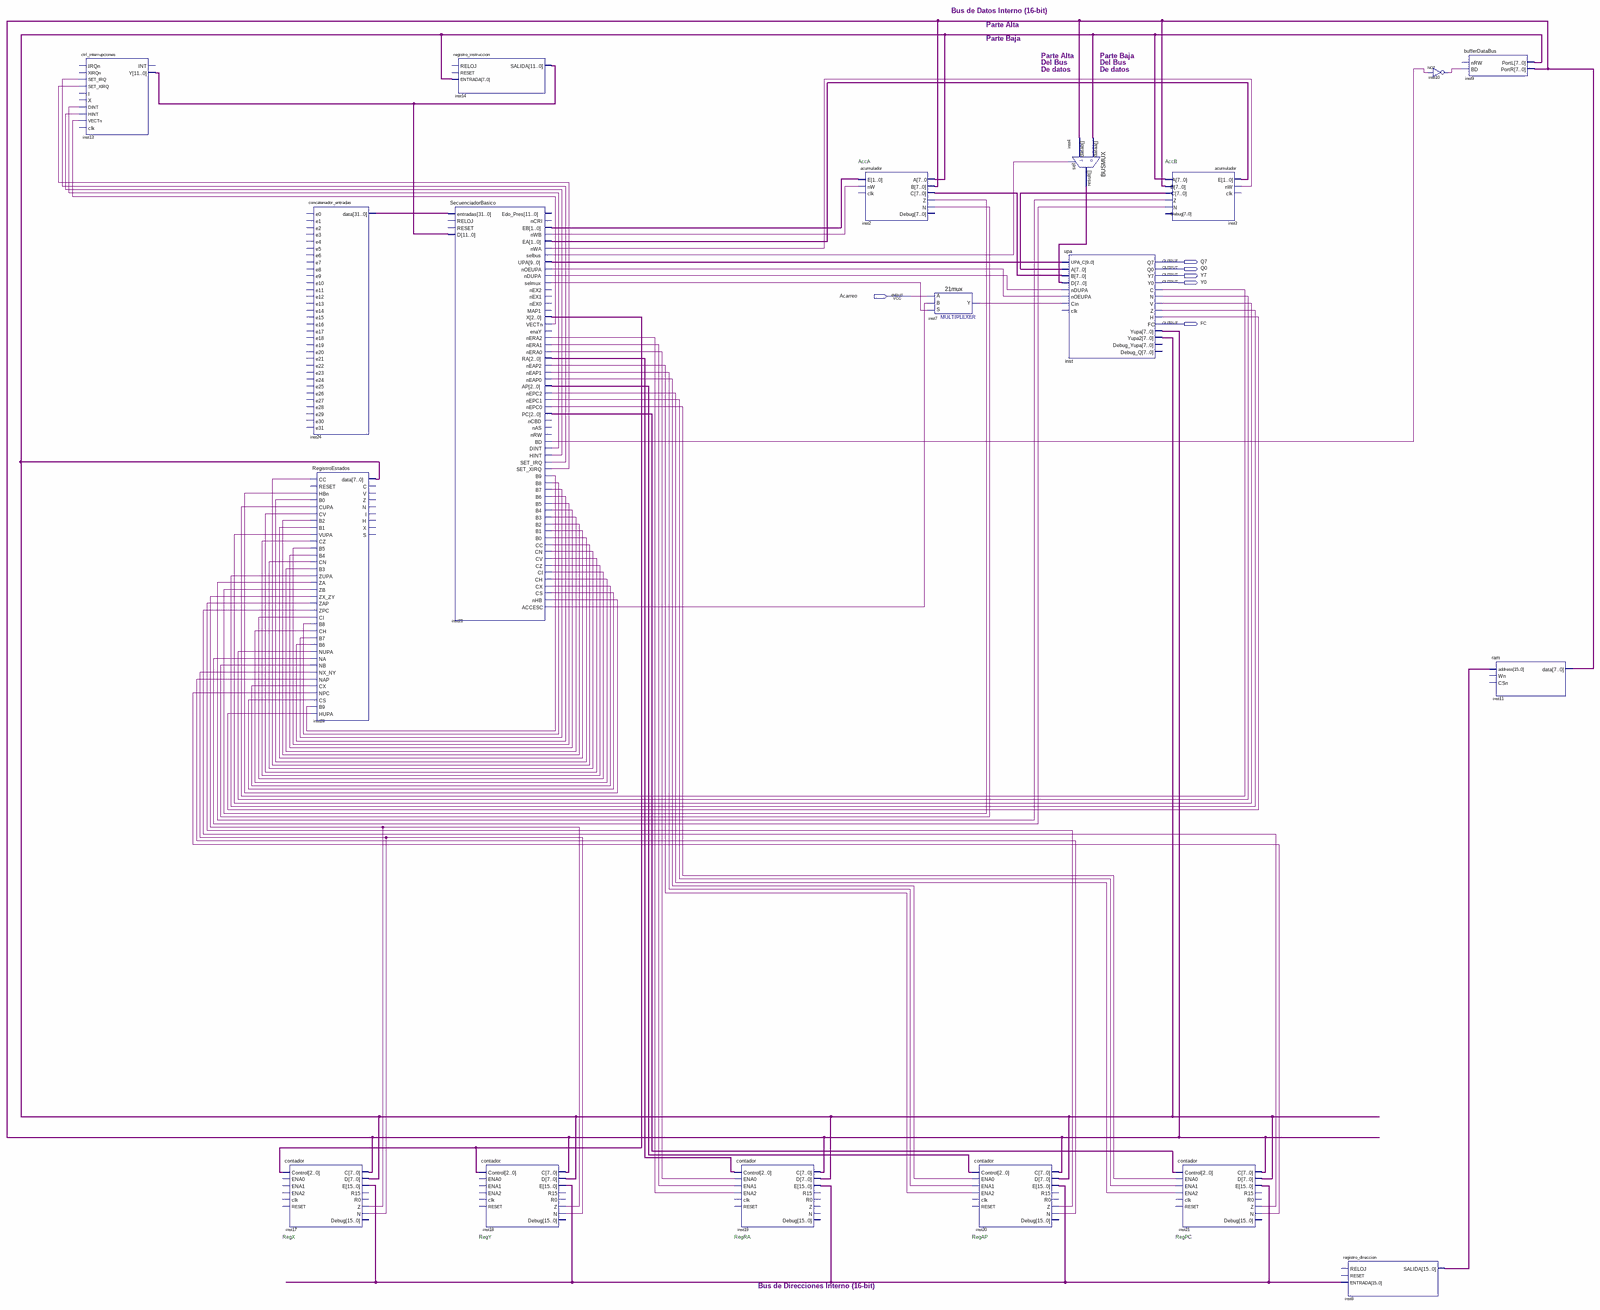
[diagram p0: schematic sheet, whole]
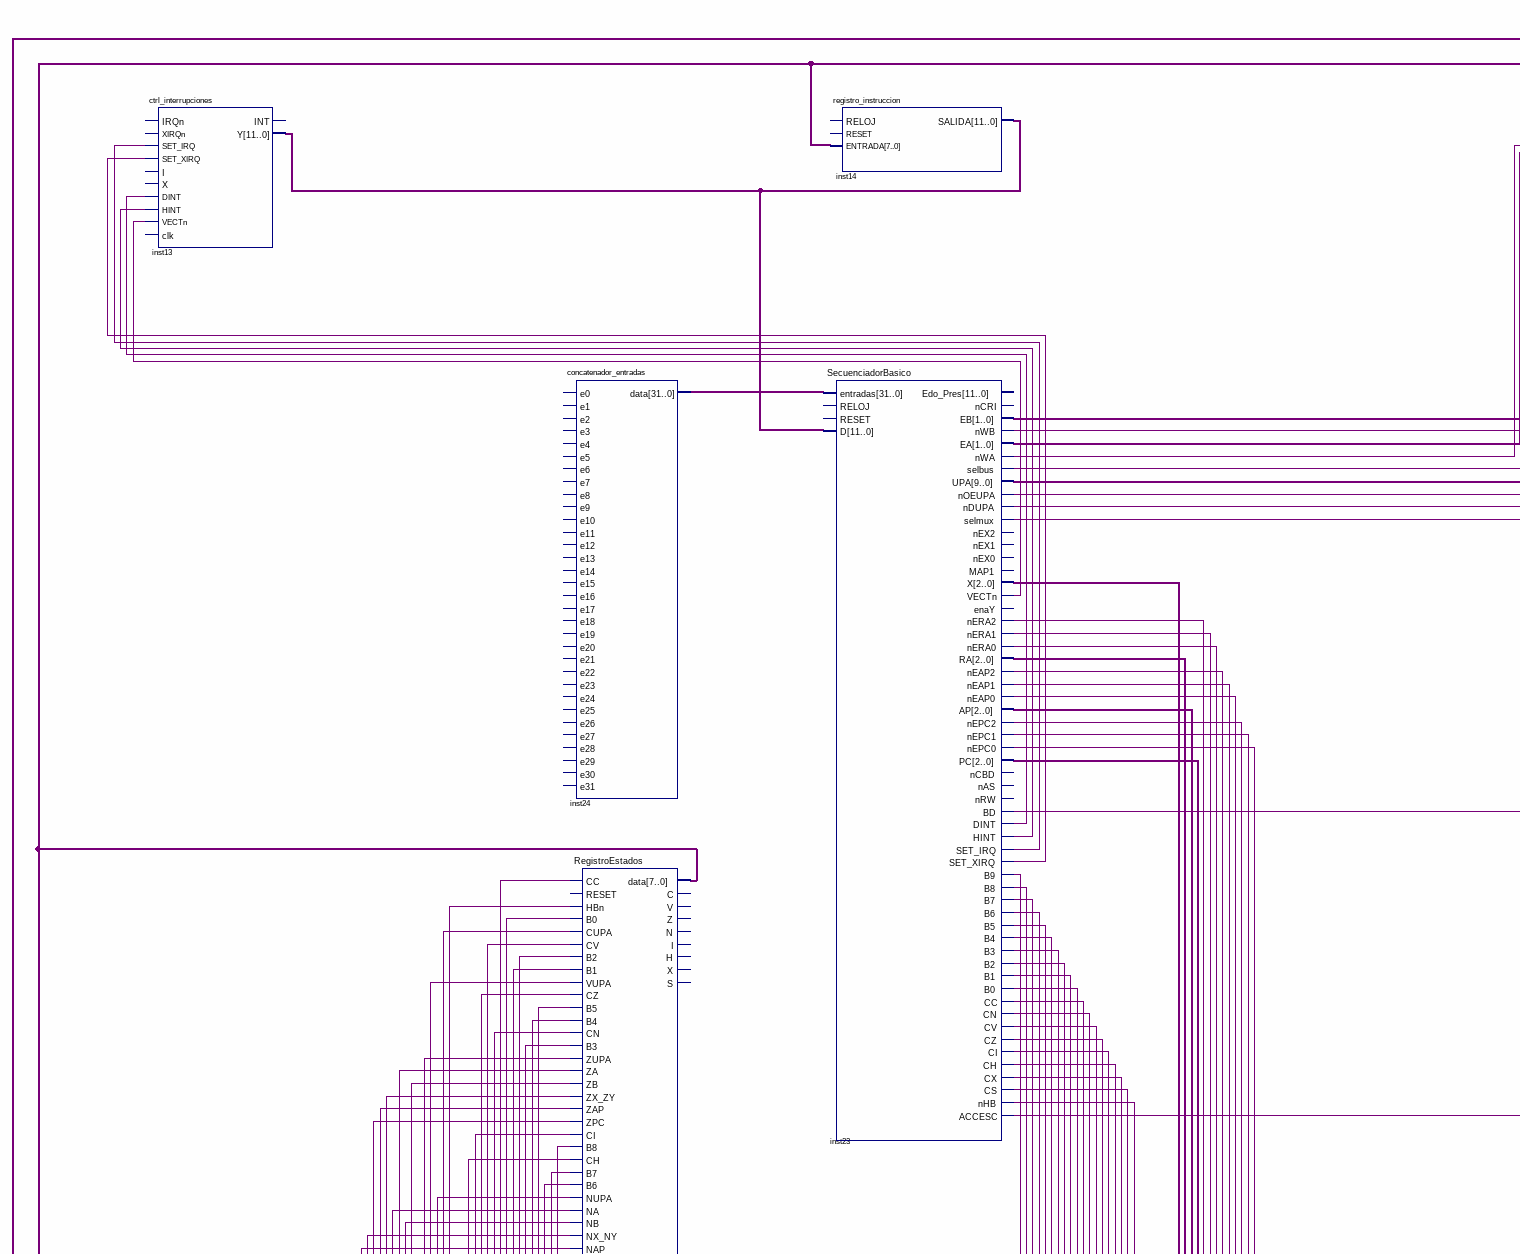
[diagram p1: schematic sheet, upper left part]
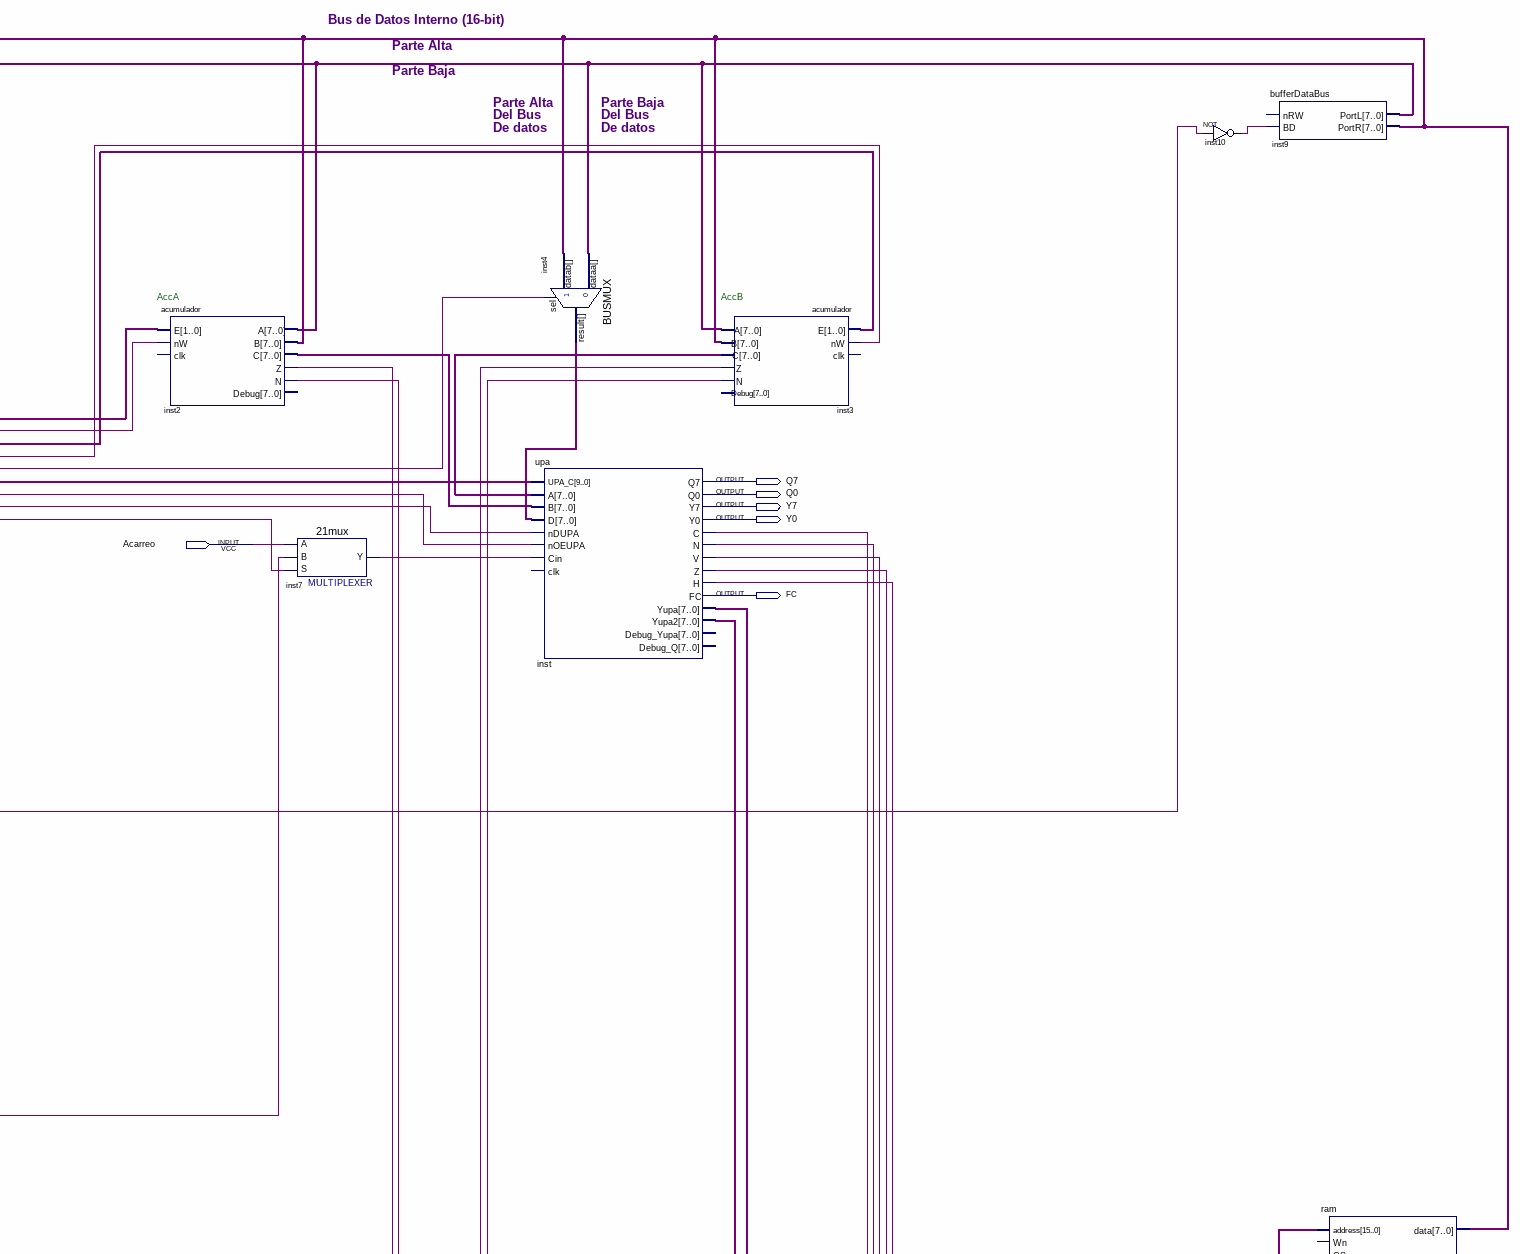
[diagram p2: schematic sheet, upper right part]
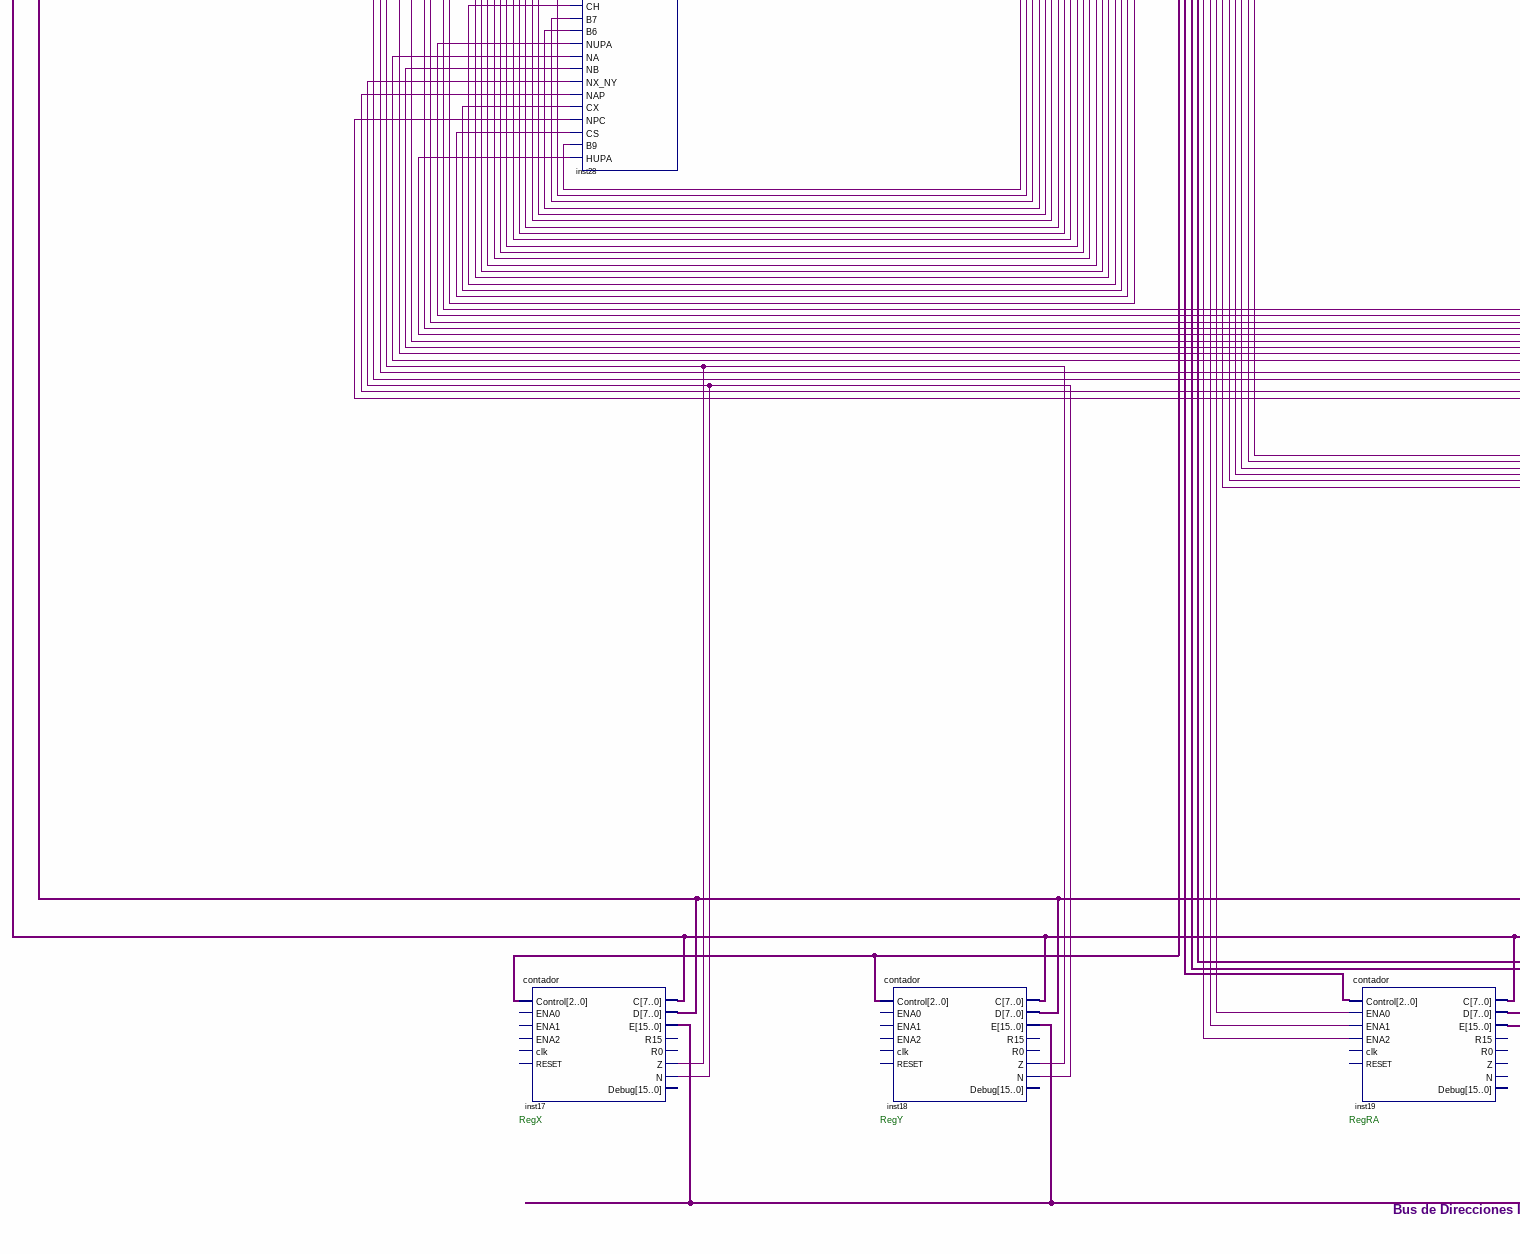
[diagram p3: schematic sheet, lower left part]
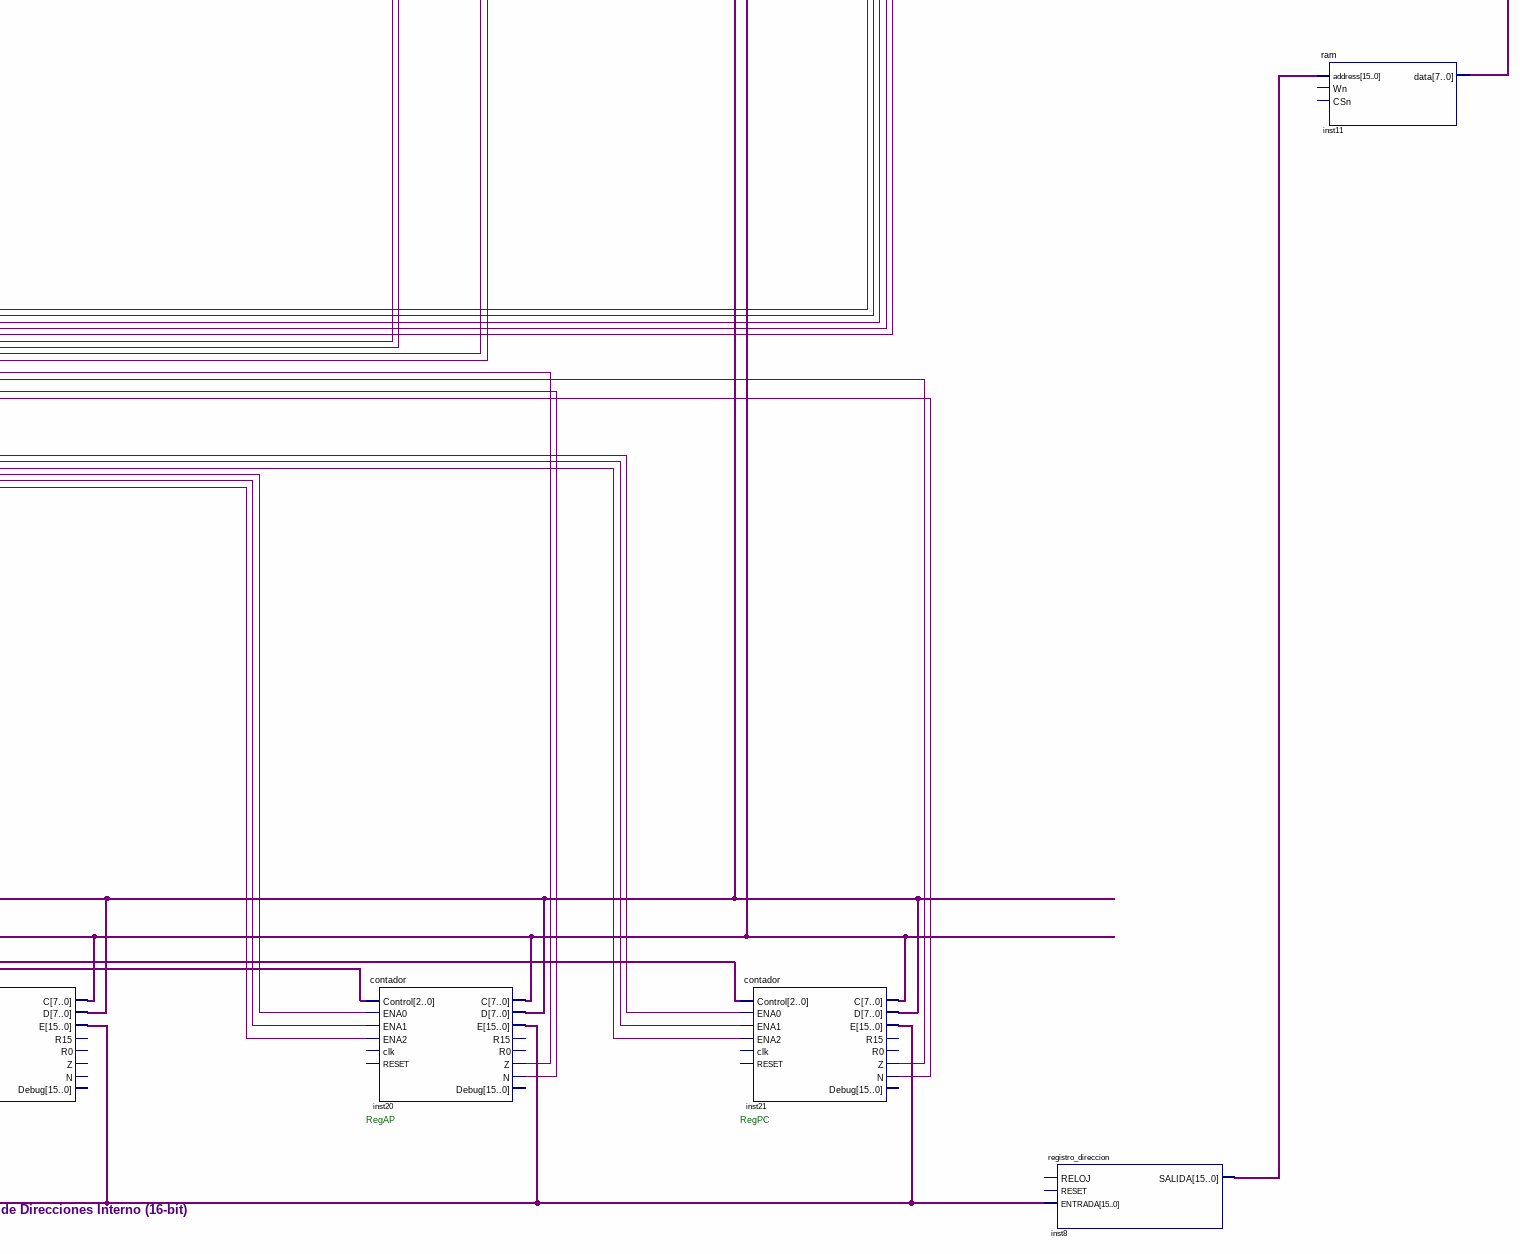
[diagram p4: schematic sheet, lower right part]
// Quartus schematic practica7.bdf as structural Verilog: 19 symbols, 6 pins
module practica7 (
  input  Acarreo,
  output Q7,
  output Q0,
  output Y7,
  output Y0,
  output FC
);

  wire inst2_n, inst2_z, inst3_n, inst3_z, inst7_y, inst10_out, inst17_n, inst17_z, inst20_n, inst20_z,
       inst21_n, inst21_z, inst23_accesc, inst23_b0, inst23_b1, inst23_b2, inst23_b3, inst23_b4, inst23_b5,
       inst23_b6, inst23_b7, inst23_b8, inst23_b9, inst23_bd, inst23_cc, inst23_ch, inst23_ci, inst23_cn,
       inst23_cs, inst23_cv, inst23_cx, inst23_cz, inst23_dint, inst23_hint, inst23_ndupa, inst23_neap0,
       inst23_neap1, inst23_neap2, inst23_nepc0, inst23_nepc1, inst23_nepc2, inst23_nera0, inst23_nera1,
       inst23_nera2, inst23_nhb, inst23_noeupa, inst23_nwa, inst23_nwb, inst23_selbus, inst23_selmux,
       inst23_set_irq, inst23_set_xirq, inst23_vectn, inst_c, inst_h, inst_n, inst_v, inst_z;
  wire [1:0] inst23_ea, inst23_eb;
  wire [2:0] inst23_ap, inst23_pc, inst23_ra, inst23_x;
  wire [7:0] inst2_c, inst3_c, inst4_result, inst17_c, inst17_d;
  wire [9:0] inst23_upa;
  wire [11:0] inst13_y;
  wire [15:0] inst8_salida, inst17_e;
  wire [31:0] inst24_data;

  ctrl_interrupciones inst13 (
    .SET_IRQ(inst23_set_irq), .SET_XIRQ(inst23_set_xirq), .DINT(inst23_dint), .HINT(inst23_hint),
    .VECTn(inst23_vectn), .Y(inst13_y));  // open: IRQn, XIRQn, I, X, clk, INT
  contador inst17 (
    .Control(inst23_x), .E(inst17_e), .Z(inst17_z), .N(inst17_n), .C(inst17_c), .D(inst17_d));  // open: ENA0, ENA1, ENA2, clk, RESET, Debug, R15, R0
  concatenador_entradas inst24 (.data(inst24_data));  // open: e0, e1, e2, e3, e4, e5, e6, e7, e8, e9, e10, e11, e12, e13, e14, e15, e16, e17, e18, e19, e20, e21, e22, e23, e24, e25, e26, e27, e28, e29, e30, e31
  RegistroEstados inst28 (
    .CC(inst23_cc), .HBn(inst23_nhb), .B0(inst23_b0), .CUPA(inst_c), .CV(inst23_cv), .B2(inst23_b2),
    .B1(inst23_b1), .VUPA(inst_v), .CZ(inst23_cz), .B5(inst23_b5), .B4(inst23_b4), .CN(inst23_cn),
    .B3(inst23_b3), .ZUPA(inst_z), .ZA(inst3_z), .ZB(inst2_z), .ZX_ZY(inst17_z), .ZAP(inst20_z),
    .ZPC(inst21_z), .CI(inst23_ci), .B8(inst23_b8), .CH(inst23_ch), .B7(inst23_b7), .B6(inst23_b6),
    .NUPA(inst_n), .NA(inst3_n), .NB(inst2_n), .NX_NY(inst17_n), .NAP(inst20_n), .CX(inst23_cx),
    .NPC(inst21_n), .CS(inst23_cs), .B9(inst23_b9), .HUPA(inst_h), .data(inst17_d));  // open: RESET, C, V, Z, N, I, H, X, S
  SecuenciadorBasico inst23 (
    .entradas(inst24_data), .D(inst13_y), .EB(inst23_eb), .nWB(inst23_nwb), .EA(inst23_ea), .nWA(inst23_nwa),
    .selbus(inst23_selbus), .UPA(inst23_upa), .nOEUPA(inst23_noeupa), .nDUPA(inst23_ndupa),
    .selmux(inst23_selmux), .X(inst23_x), .VECTn(inst23_vectn), .nERA2(inst23_nera2), .nERA1(inst23_nera1),
    .nERA0(inst23_nera0), .RA(inst23_ra), .nEAP2(inst23_neap2), .nEAP1(inst23_neap1), .nEAP0(inst23_neap0),
    .AP(inst23_ap), .nEPC2(inst23_nepc2), .nEPC1(inst23_nepc1), .nEPC0(inst23_nepc0), .PC(inst23_pc),
    .BD(inst23_bd), .DINT(inst23_dint), .HINT(inst23_hint), .SET_IRQ(inst23_set_irq),
    .SET_XIRQ(inst23_set_xirq), .B9(inst23_b9), .B8(inst23_b8), .B7(inst23_b7), .B6(inst23_b6),
    .B5(inst23_b5), .B4(inst23_b4), .B3(inst23_b3), .B2(inst23_b2), .B1(inst23_b1), .B0(inst23_b0),
    .CC(inst23_cc), .CN(inst23_cn), .CV(inst23_cv), .CZ(inst23_cz), .CI(inst23_ci), .CH(inst23_ch),
    .CX(inst23_cx), .CS(inst23_cs), .nHB(inst23_nhb), .ACCESC(inst23_accesc));  // open: RELOJ, RESET, Edo_Pres, nCRI, nEX2, nEX1, nEX0, MAP1, enaY, nCBD, nAS, nRW
  registro_instruccion inst14 (.ENTRADA(inst17_d), .SALIDA(inst13_y));  // open: RELOJ, RESET
  contador inst18 (
    .Control(inst23_x), .E(inst17_e), .Z(inst17_z), .N(inst17_n), .C(inst17_c), .D(inst17_d));  // open: ENA0, ENA1, ENA2, clk, RESET, Debug, R15, R0
  contador inst19 (
    .Control(inst23_ra), .ENA0(inst23_nera0), .ENA1(inst23_nera1), .ENA2(inst23_nera2), .E(inst17_e),
    .C(inst17_c), .D(inst17_d));  // open: clk, RESET, Z, N, Debug, R15, R0
  acumulador inst2 (
    .E(inst23_eb), .nW(inst23_nwb), .Z(inst2_z), .N(inst2_n), .A(inst17_d), .B(inst17_c), .C(inst2_c));  // open: clk, Debug
  \21mux  inst7 (.S(inst23_selmux), .B(inst23_accesc), .A(Acarreo), .Y(inst7_y));
  contador inst20 (
    .Control(inst23_ap), .ENA0(inst23_neap0), .ENA1(inst23_neap1), .ENA2(inst23_neap2), .E(inst17_e),
    .Z(inst20_z), .N(inst20_n), .C(inst17_c), .D(inst17_d));  // open: clk, RESET, Debug, R15, R0
  BUSMUX inst4 (.datab(inst17_c), .sel(inst23_selbus), .dataa(inst17_d), .result(inst4_result));
  upa inst (
    .UPA_C(inst23_upa), .A(inst3_c), .B(inst2_c), .D(inst4_result), .nDUPA(inst23_ndupa),
    .nOEUPA(inst23_noeupa), .Cin(inst7_y), .Q7(Q7), .Q0(Q0), .Y7(Y7), .Y0(Y0), .C(inst_c), .N(inst_n),
    .V(inst_v), .Z(inst_z), .H(inst_h), .FC(FC), .Yupa(inst17_c), .Yupa2(inst17_d));  // open: clk, Debug_Yupa, Debug_Q
  acumulador inst3 (
    .E(inst23_ea), .nW(inst23_nwa), .Z(inst3_z), .N(inst3_n), .A(inst17_d), .B(inst17_c), .C(inst3_c));  // open: clk, Debug
  contador inst21 (
    .Control(inst23_pc), .ENA0(inst23_nepc0), .ENA1(inst23_nepc1), .ENA2(inst23_nepc2), .E(inst17_e),
    .Z(inst21_z), .N(inst21_n), .C(inst17_c), .D(inst17_d));  // open: clk, RESET, Debug, R15, R0
  registro_direccion inst8 (.ENTRADA(inst17_e), .SALIDA(inst8_salida));  // open: RELOJ, RESET
  not inst10 (inst10_out, inst23_bd);
  bufferDataBus inst9 (.BD(inst10_out), .PortL(inst17_d), .PortR(inst17_c));  // open: nRW
  ram inst11 (.address(inst8_salida), .data(inst17_c));  // open: Wn, CSn

  // Notes on the sheet:
  //   Bus de Datos Interno (16-bit)
  //   Parte Alta
  //   Parte Baja
  //   Parte Alta
  //   Parte Baja
  //   Del Bus
  //   Del Bus
  //   De datos
  //   De datos
  //   AccA
  //   AccB
  //   RegX
  //   RegY
  //   RegRA
  //   RegAP
  //   RegPC
  //   Bus de Direcciones Interno (16-bit)
endmodule
